# EAGLE design CarrierBoard (EAGLE 5.06)
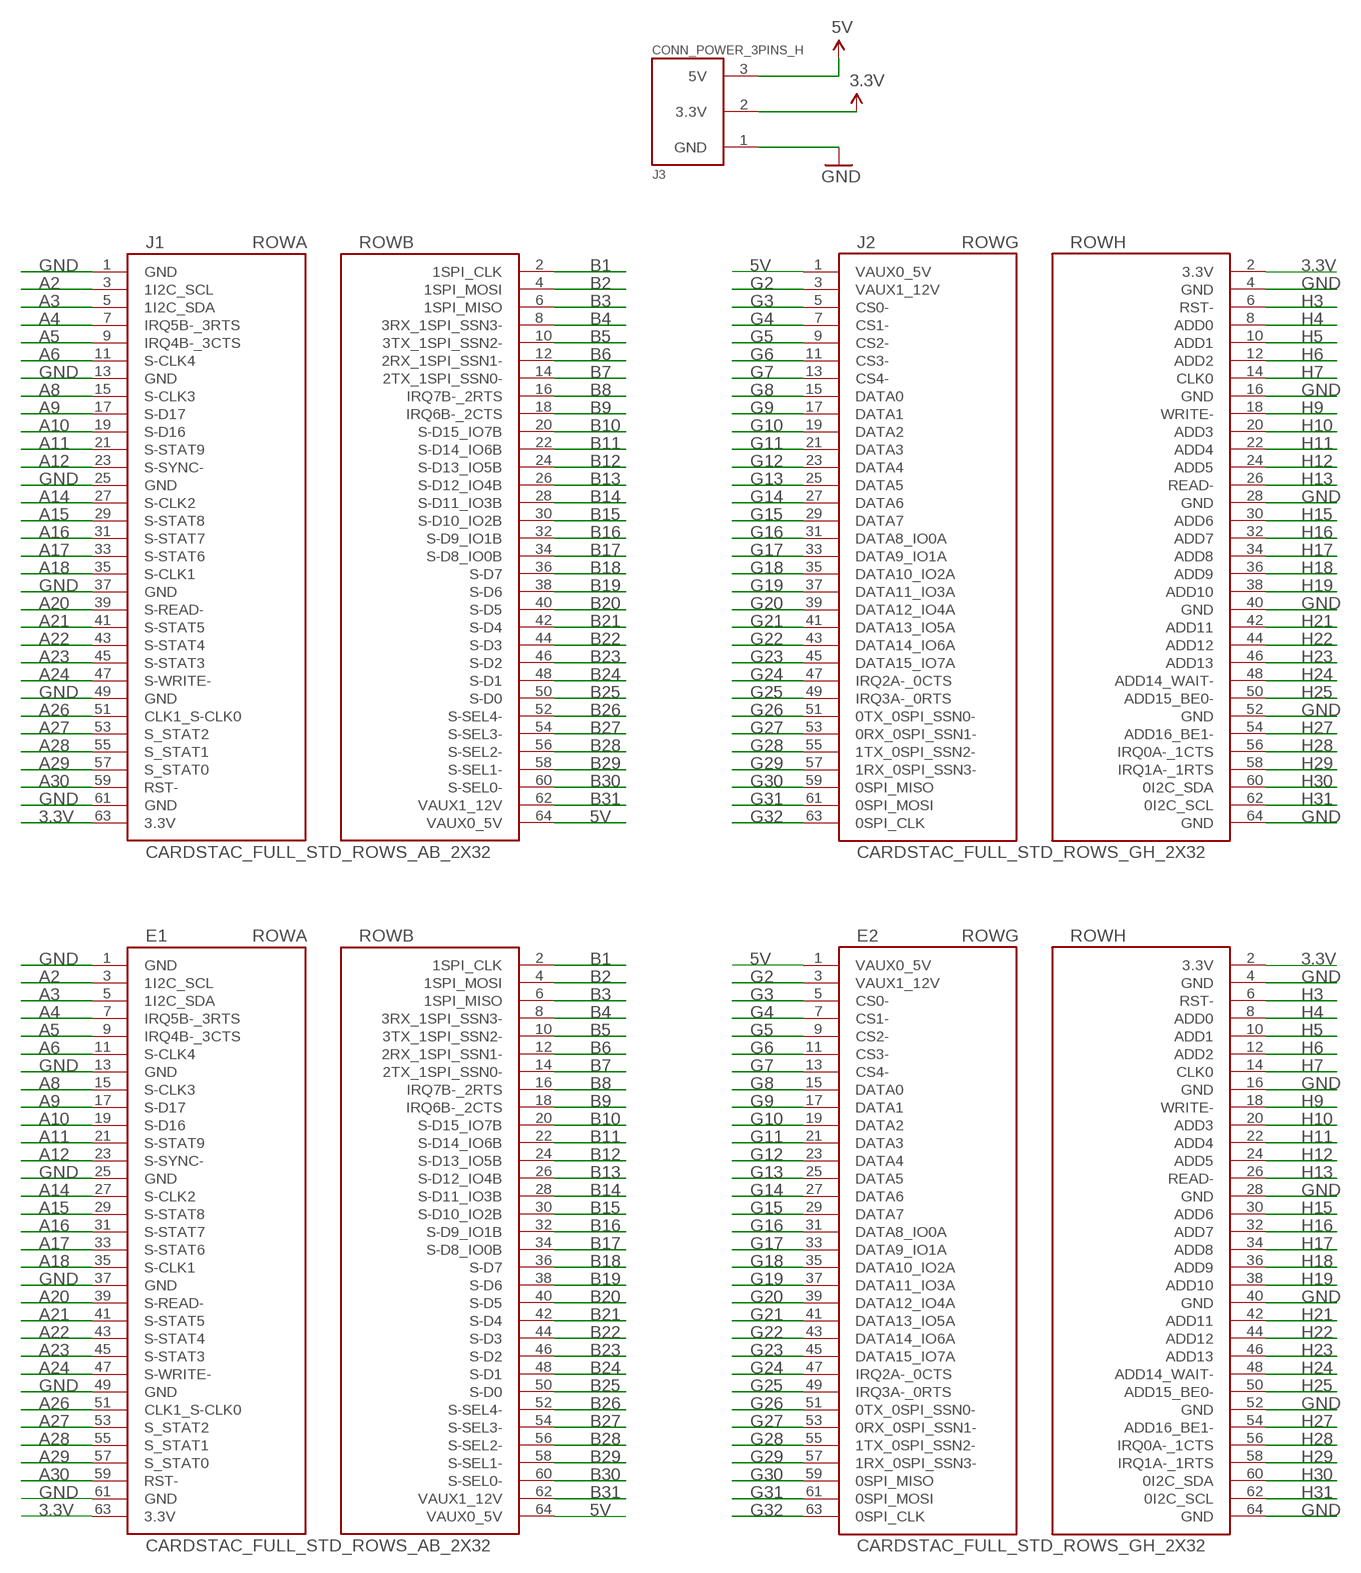
[diagram p0: schematic, sheet 1]

## Parts
E1  CARDSTAC_FULL_STD_ROWS_AB_2X32  [2X32]
E2  CARDSTAC_FULL_STD_ROWS_GH_2X32  [2X32]
J1  CARDSTAC_FULL_STD_ROWS_AB_2X32  [2X32]
J2  CARDSTAC_FULL_STD_ROWS_GH_2X32  [2X32]
J3  CONN_POWER_3PINS_H  [3PINS_3.81MM_90DEG]

## Nets
3.3V: E1.63(3.3V) E2.2(3.3V) J1.63(3.3V) J2.2(3.3V) J3.2(3.3V)
5V: E1.64(VAUX0_5V) E2.1(VAUX0_5V) J1.64(VAUX0_5V) J2.1(VAUX0_5V) J3.3(5V)
A2: E1.3(1I2C_SCL) J1.3(1I2C_SCL)
A3: E1.5(1I2C_SDA) J1.5(1I2C_SDA)
A4: E1.7(IRQ5B-_3RTS) J1.7(IRQ5B-_3RTS)
A5: E1.9(IRQ4B-_3CTS) J1.9(IRQ4B-_3CTS)
A6: E1.11(S-CLK4) J1.11(S-CLK4)
A8: E1.15(S-CLK3) J1.15(S-CLK3)
A9: E1.17(S-D17) J1.17(S-D17)
A10: E1.19(S-D16) J1.19(S-D16)
A11: E1.21(S-STAT9) J1.21(S-STAT9)
A12: E1.23(S-SYNC-) J1.23(S-SYNC-)
A14: E1.27(S-CLK2) J1.27(S-CLK2)
A15: E1.29(S-STAT8) J1.29(S-STAT8)
A16: E1.31(S-STAT7) J1.31(S-STAT7)
A17: E1.33(S-STAT6) J1.33(S-STAT6)
A18: E1.35(S-CLK1) J1.35(S-CLK1)
A20: E1.39(S-READ-) J1.39(S-READ-)
A21: E1.41(S-STAT5) J1.41(S-STAT5)
A22: E1.43(S-STAT4) J1.43(S-STAT4)
A23: E1.45(S-STAT3) J1.45(S-STAT3)
A24: E1.47(S-WRITE-) J1.47(S-WRITE-)
A26: E1.51(CLK1_S-CLK0) J1.51(CLK1_S-CLK0)
A27: E1.53(S_STAT2) J1.53(S_STAT2)
A28: E1.55(S_STAT1) J1.55(S_STAT1)
A29: E1.57(S_STAT0) J1.57(S_STAT0)
A30: E1.59(RST-) J1.59(RST-)
B1: E1.2(1SPI_CLK) J1.2(1SPI_CLK)
B2: E1.4(1SPI_MOSI) J1.4(1SPI_MOSI)
B3: E1.6(1SPI_MISO) J1.6(1SPI_MISO)
B4: E1.8(3RX_1SPI_SSN3-) J1.8(3RX_1SPI_SSN3-)
B5: E1.10(3TX_1SPI_SSN2-) J1.10(3TX_1SPI_SSN2-)
B6: E1.12(2RX_1SPI_SSN1-) J1.12(2RX_1SPI_SSN1-)
B7: E1.14(2TX_1SPI_SSN0-) J1.14(2TX_1SPI_SSN0-)
B8: E1.16(IRQ7B-_2RTS) J1.16(IRQ7B-_2RTS)
B9: E1.18(IRQ6B-_2CTS) J1.18(IRQ6B-_2CTS)
B10: E1.20(S-D15_IO7B) J1.20(S-D15_IO7B)
B11: E1.22(S-D14_IO6B) J1.22(S-D14_IO6B)
B12: E1.24(S-D13_IO5B) J1.24(S-D13_IO5B)
B13: E1.26(S-D12_IO4B) J1.26(S-D12_IO4B)
B14: E1.28(S-D11_IO3B) J1.28(S-D11_IO3B)
B15: E1.30(S-D10_IO2B) J1.30(S-D10_IO2B)
B16: E1.32(S-D9_IO1B) J1.32(S-D9_IO1B)
B17: E1.34(S-D8_IO0B) J1.34(S-D8_IO0B)
B18: E1.36(S-D7) J1.36(S-D7)
B19: E1.38(S-D6) J1.38(S-D6)
B20: E1.40(S-D5) J1.40(S-D5)
B21: E1.42(S-D4) J1.42(S-D4)
B22: E1.44(S-D3) J1.44(S-D3)
B23: E1.46(S-D2) J1.46(S-D2)
B24: E1.48(S-D1) J1.48(S-D1)
B25: E1.50(S-D0) J1.50(S-D0)
B26: E1.52(S-SEL4-) J1.52(S-SEL4-)
B27: E1.54(S-SEL3-) J1.54(S-SEL3-)
B28: E1.56(S-SEL2-) J1.56(S-SEL2-)
B29: E1.58(S-SEL1-) J1.58(S-SEL1-)
B30: E1.60(S-SEL0-) J1.60(S-SEL0-)
B31: E1.62(VAUX1_12V) J1.62(VAUX1_12V)
G2: E2.3(VAUX1_12V) J2.3(VAUX1_12V)
G3: E2.5(CS0-) J2.5(CS0-)
G4: E2.7(CS1-) J2.7(CS1-)
G5: E2.9(CS2-) J2.9(CS2-)
G6: E2.11(CS3-) J2.11(CS3-)
G7: E2.13(CS4-) J2.13(CS4-)
G8: E2.15(DATA0) J2.15(DATA0)
G9: E2.17(DATA1) J2.17(DATA1)
G10: E2.19(DATA2) J2.19(DATA2)
G11: E2.21(DATA3) J2.21(DATA3)
G12: E2.23(DATA4) J2.23(DATA4)
G13: E2.25(DATA5) J2.25(DATA5)
G14: E2.27(DATA6) J2.27(DATA6)
G15: E2.29(DATA7) J2.29(DATA7)
G16: E2.31(DATA8_IO0A) J2.31(DATA8_IO0A)
G17: E2.33(DATA9_IO1A) J2.33(DATA9_IO1A)
G18: E2.35(DATA10_IO2A) J2.35(DATA10_IO2A)
G19: E2.37(DATA11_IO3A) J2.37(DATA11_IO3A)
G20: E2.39(DATA12_IO4A) J2.39(DATA12_IO4A)
G21: E2.41(DATA13_IO5A) J2.41(DATA13_IO5A)
G22: E2.43(DATA14_IO6A) J2.43(DATA14_IO6A)
G23: E2.45(DATA15_IO7A) J2.45(DATA15_IO7A)
G24: E2.47(IRQ2A-_0CTS) J2.47(IRQ2A-_0CTS)
G25: E2.49(IRQ3A-_0RTS) J2.49(IRQ3A-_0RTS)
G26: E2.51(0TX_0SPI_SSN0-) J2.51(0TX_0SPI_SSN0-)
G27: E2.53(0RX_0SPI_SSN1-) J2.53(0RX_0SPI_SSN1-)
G28: E2.55(1TX_0SPI_SSN2-) J2.55(1TX_0SPI_SSN2-)
G29: E2.57(1RX_0SPI_SSN3-) J2.57(1RX_0SPI_SSN3-)
G30: E2.59(0SPI_MISO) J2.59(0SPI_MISO)
G31: E2.61(0SPI_MOSI) J2.61(0SPI_MOSI)
G32: E2.63(0SPI_CLK) J2.63(0SPI_CLK)
GND: E1.1(GND) E1.13(GND) E1.25(GND) E1.37(GND) E1.49(GND) E1.61(GND) E2.4(GND) E2.16(GND) E2.28(GND) E2.40(GND) E2.52(GND) E2.64(GND) J1.1(GND) J1.13(GND) J1.25(GND) J1.37(GND) J1.49(GND) J1.61(GND) J2.4(GND) J2.16(GND) J2.28(GND) J2.40(GND) J2.52(GND) J2.64(GND) J3.1(GND)
H3: E2.6(RST-) J2.6(RST-)
H4: E2.8(ADD0) J2.8(ADD0)
H5: E2.10(ADD1) J2.10(ADD1)
H6: E2.12(ADD2) J2.12(ADD2)
H7: E2.14(CLK0) J2.14(CLK0)
H9: E2.18(WRITE-) J2.18(WRITE-)
H10: E2.20(ADD3) J2.20(ADD3)
H11: E2.22(ADD4) J2.22(ADD4)
H12: E2.24(ADD5) J2.24(ADD5)
H13: E2.26(READ-) J2.26(READ-)
H15: E2.30(ADD6) J2.30(ADD6)
H16: E2.32(ADD7) J2.32(ADD7)
H17: E2.34(ADD8) J2.34(ADD8)
H18: E2.36(ADD9) J2.36(ADD9)
H19: E2.38(ADD10) J2.38(ADD10)
H21: E2.42(ADD11) J2.42(ADD11)
H22: E2.44(ADD12) J2.44(ADD12)
H23: E2.46(ADD13) J2.46(ADD13)
H24: E2.48(ADD14_WAIT-) J2.48(ADD14_WAIT-)
H25: E2.50(ADD15_BE0-) J2.50(ADD15_BE0-)
H27: E2.54(ADD16_BE1-) J2.54(ADD16_BE1-)
H28: E2.56(IRQ0A-_1CTS) J2.56(IRQ0A-_1CTS)
H29: E2.58(IRQ1A-_1RTS) J2.58(IRQ1A-_1RTS)
H30: E2.60(0I2C_SDA) J2.60(0I2C_SDA)
H31: E2.62(0I2C_SCL) J2.62(0I2C_SCL)

## Library data of the parts
E1 J1 = Robot:CARDSTAC_FULL_STD_ROWS_AB: Rows A and B of the Cardstac specification.
E2 J2 = Robot:CARDSTAC_FULL_STD_ROWS_GH: Rows G and H of the Cardstac specification.
J3 = Robot:CONN_POWER_3PINS: POWER CONNECTOR for logic boards. Provides 3.3V and 5V.

## Board
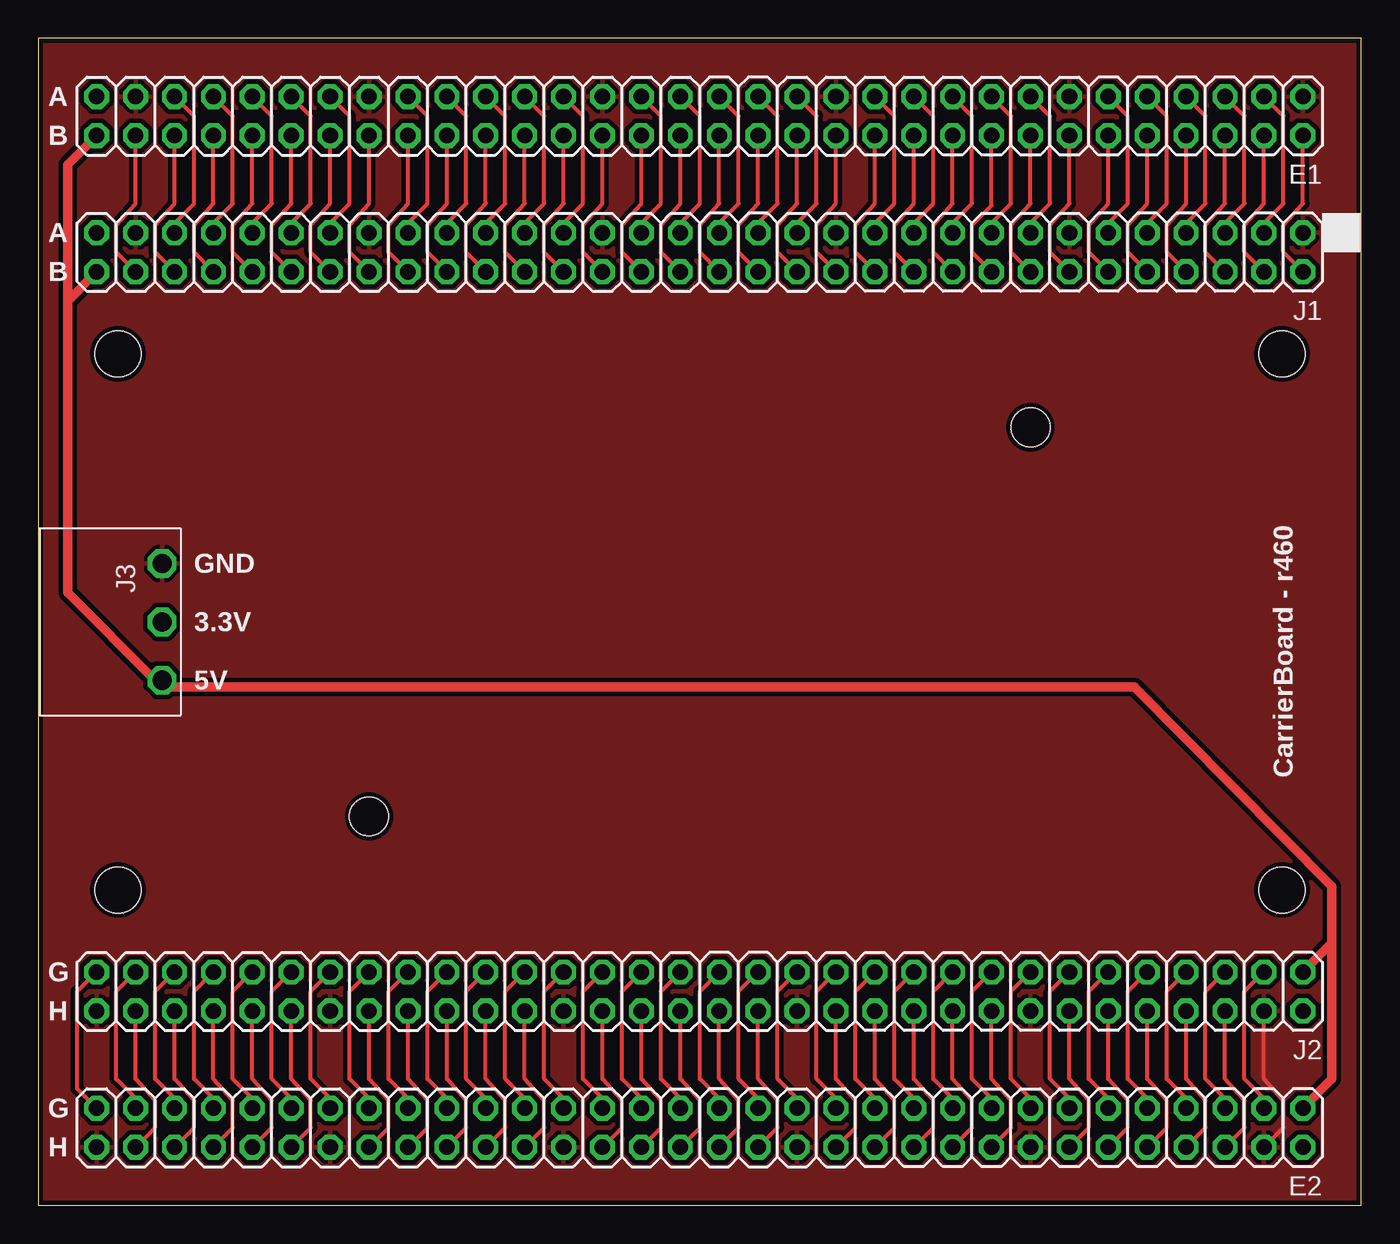
[diagram p1: board, top side]
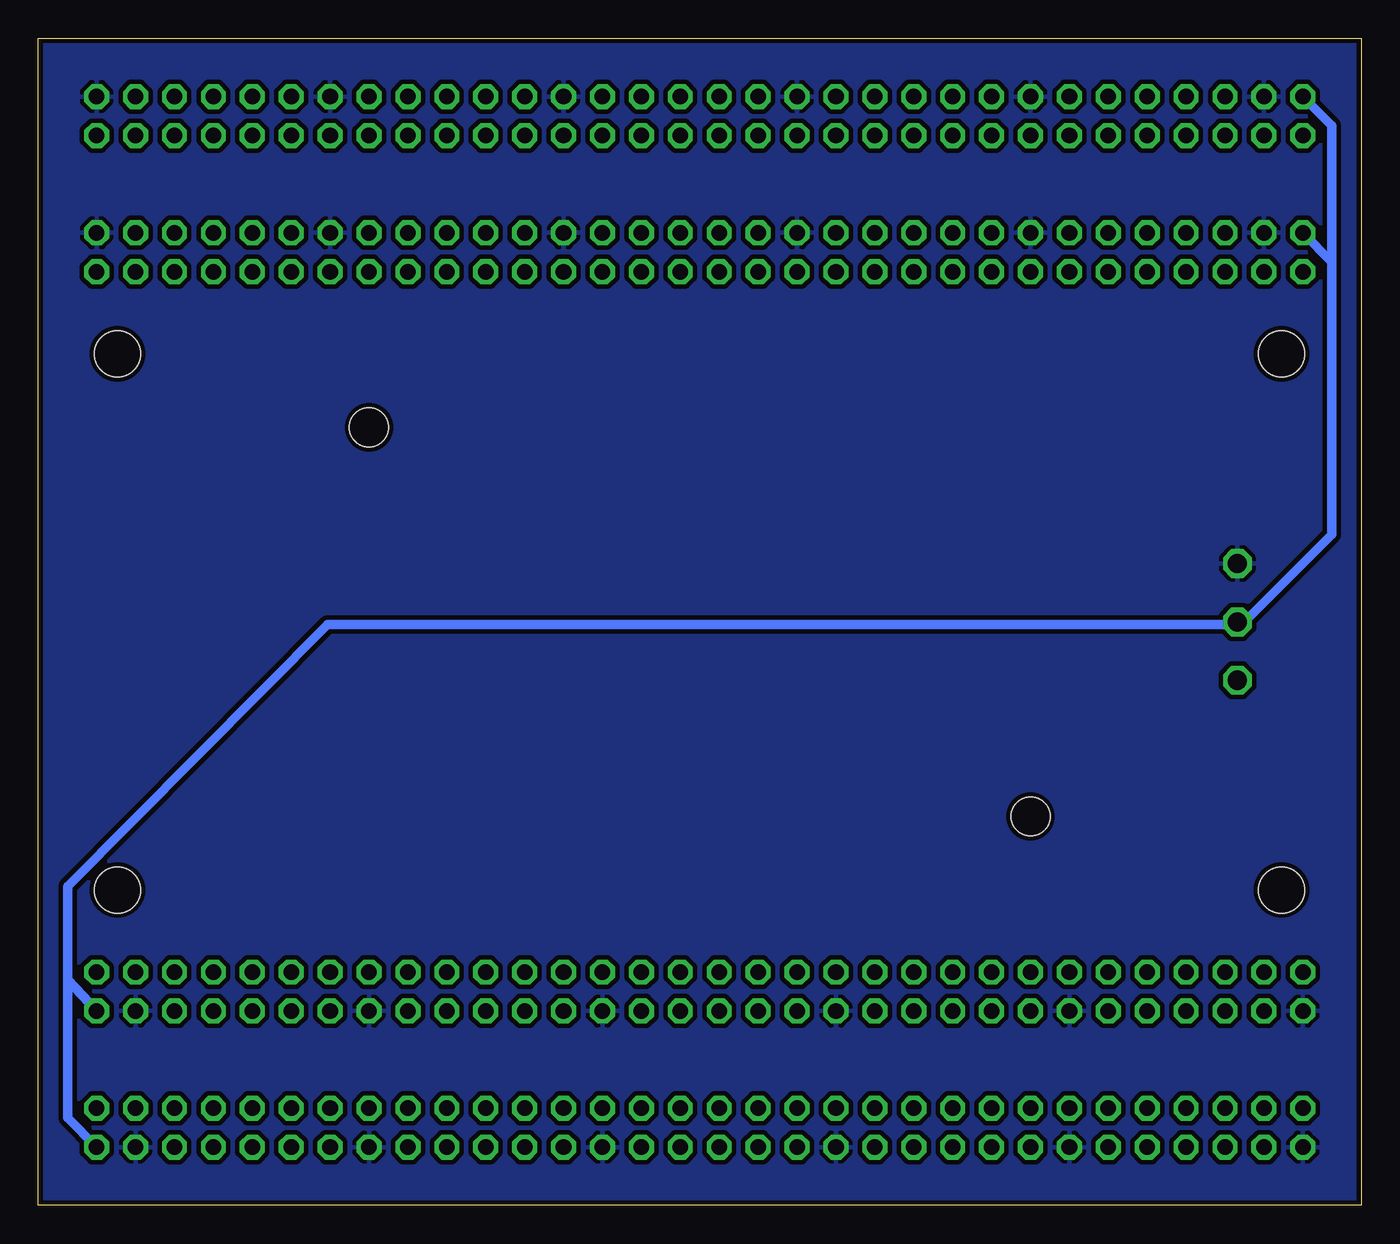
[diagram p2: board, bottom side, seen from below]

Size 86.36 x 76.2 mm. Coordinates in mm from the lower left corner, seen from the top.
Outline: 0,0 86.36,0 86.36,76.2 0,76.2 0,0
Copper layers (1*16): Top 0.035mm / dielectric 1.5mm / Bottom 0.035mm
Design rules "SparkFun": minimum track width 8mil, minimum drill 20mil, track to track 8mil, track to pad 8mil, pad to pad 8mil, via to via 8mil, smd to smd 8mil, copper to edge 10mil, drill to drill 8mil, minimum pad ring 12mil, minimum via ring 10mil, stop-mask expansion 4mil, vias tented up to drill 25mil, thermal gap 10mil
Holes 2.54 mm at 64.77,50.8 21.59,25.4
Holes 3 mm at 5.2,55.6 5.2,20.6 81.2,55.6 81.2,20.6

### Footprints (pad centres in the part's own frame; a part is rotated, then mirrored left to right if it is on the bottom)
2X32 = drill 1.016 octagon: 1 -39.37,-1.27; 2 -39.37,1.27; 3 -36.83,-1.27; 4 -36.83,1.27; 5 -34.29,-1.27; 6 -34.29,1.27; 7 -31.75,-1.27; 8 -31.75,1.27; 9 -29.21,-1.27; 10 -29.21,1.27; 11 -26.67,-1.27; 12 -26.67,1.27; 13 -24.13,-1.27; 14 -24.13,1.27; 15 -21.59,-1.27; 16 -21.59,1.27; 17 -19.05,-1.27; 18 -19.05,1.27; 19 -16.51,-1.27; 20 -16.51,1.27; 21 -13.97,-1.27; 22 -13.97,1.27; 23 -11.43,-1.27; 24 -11.43,1.27; 25 -8.89,-1.27; 26 -8.89,1.27; 27 -6.35,-1.27; 28 -6.35,1.27; 29 -3.81,-1.27; 30 -3.81,1.27; 31 -1.27,-1.27; 32 -1.27,1.27; 33 1.27,-1.27; 34 1.27,1.27; 35 3.81,-1.27; 36 3.81,1.27; 37 6.35,-1.27; 38 6.35,1.27; 39 8.89,-1.27; 40 8.89,1.27; 41 11.43,-1.27; 42 11.43,1.27; 43 13.97,-1.27; 44 13.97,1.27; 45 16.51,-1.27; 46 16.51,1.27; 47 19.05,-1.27; 48 19.05,1.27; 49 21.59,-1.27; 50 21.59,1.27; 51 24.13,-1.27; 52 24.13,1.27; 53 26.67,-1.27; 54 26.67,1.27; 55 29.21,-1.27; 56 29.21,1.27; 57 31.75,-1.27; 58 31.75,1.27; 59 34.29,-1.27; 60 34.29,1.27; 61 36.83,-1.27; 62 36.83,1.27; 63 39.37,-1.27; 64 39.37,1.27
3PINS_3.81MM_90DEG = drill 1.25 octagon: 1 -3.81,3; 2 0,3; 3 3.81,3

### Placement (x,y rotation side)
E1  43.18,71.12 180 top
E2  43.18,5.08 180 top
J1  43.18,62.23 180 top
J2  43.18,13.97 180 top
J3  5.08,38.1 270 top

### Tracks (layer width: path | path; a pad name or v marks a point on that pad's centre or on a via)
3.3V
  Bottom 0.61: E2.2 84.45,5.71 84.45,14.73 | 1.91,61.59 1.91,70.48 E1.63 | 7.62,38.1 1.91,43.81 1.91,61.59 | 1.91,61.59 J1.63 | 84.45,14.73 J2.2 | 7.62,38.1 7.78,37.94 67.47,37.94 84.45,20.83 84.45,14.73 | 7.62,38.1 J3.2
5V
  Top 0.61: E2.1 84.45,8.26 84.45,17.14 | 1.91,59.05 1.91,67.94 E1.64 | 7.62,34.29 1.91,40.01 1.91,59.05 | 1.91,59.05 J1.64 | 7.62,34.29 J3.3 | 7.62,34.29 8.05,33.86 71.55,33.86 84.45,20.83 84.45,17.14 | 84.45,17.14 J2.1
A2
  Top 0.254: J1.3 80.01,64.14 81.28,65.41 81.28,71.12 E1.3
A3
  Top 0.254: J1.5 77.47,64.14 78.74,65.41 78.74,71.12 E1.5
A4
  Top 0.254: J1.7 74.93,64.14 76.2,65.41 76.2,71.12 E1.7
A5
  Top 0.254: J1.9 72.39,64.14 73.66,65.41 73.66,71.12 E1.9
A6
  Top 0.254: J1.11 69.85,64.14 71.12,65.41 71.12,71.12 E1.11
A8
  Top 0.254: J1.15 64.77,64.14 66.04,65.41 66.04,71.12 E1.15
A9
  Top 0.254: J1.17 62.23,64.14 63.5,65.41 63.5,71.12 E1.17
A10
  Top 0.254: J1.19 59.69,64.14 60.96,65.41 60.96,71.12 E1.19
A11
  Top 0.254: J1.21 57.15,64.14 58.42,65.41 58.42,71.12 E1.21
A12
  Top 0.254: J1.23 54.61,64.14 55.88,65.41 55.88,71.12 E1.23
A14
  Top 0.254: J1.27 49.53,64.14 50.8,65.41 50.8,71.12 E1.27
A15
  Top 0.254: J1.29 46.99,64.14 48.26,65.41 48.26,71.12 E1.29
A16
  Top 0.254: J1.31 44.45,64.14 45.72,65.41 45.72,71.12 E1.31
A17
  Top 0.254: J1.33 41.91,64.14 43.18,65.41 43.18,71.12 E1.33
A18
  Top 0.254: J1.35 39.37,64.14 40.64,65.41 40.64,71.12 E1.35
A20
  Top 0.254: J1.39 34.29,64.14 35.56,65.41 35.56,71.12 E1.39
A21
  Top 0.254: J1.41 31.75,64.14 33.02,65.41 33.02,71.12 E1.41
A22
  Top 0.254: J1.43 29.21,64.14 30.48,65.41 30.48,71.12 E1.43
A23
  Top 0.254: J1.45 26.67,64.14 27.94,65.41 27.94,71.12 E1.45
A24
  Top 0.254: J1.47 24.13,64.14 25.4,65.41 25.4,71.12 E1.47
A26
  Top 0.254: J1.51 19.05,64.14 20.32,65.41 20.32,71.12 E1.51
A27
  Top 0.254: J1.53 16.51,64.14 17.78,65.41 17.78,71.12 E1.53
A28
  Top 0.254: J1.55 13.97,64.14 15.24,65.41 15.24,71.12 E1.55
A29
  Top 0.254: J1.57 11.43,64.14 12.7,65.41 12.7,71.12 E1.57
A30
  Top 0.254: J1.59 8.89,64.14 10.16,65.41 10.16,71.12 E1.59
B1
  Top 0.254: J1.2 81.28,62.23 81.28,64.01 82.55,65.41 E1.2
B2
  Top 0.254: J1.4 78.74,62.23 78.74,64.01 80.01,65.41 E1.4
B3
  Top 0.254: J1.6 76.2,62.23 76.2,64.01 77.47,65.41 E1.6
B4
  Top 0.254: J1.8 73.66,62.23 73.66,64.01 74.93,65.41 E1.8
B5
  Top 0.254: J1.10 71.12,62.23 71.12,64.01 72.39,65.41 E1.10
B6
  Top 0.254: J1.12 68.58,62.23 68.58,64.01 69.85,65.41 E1.12
B7
  Top 0.254: J1.14 66.04,62.23 66.04,64.01 67.31,65.41 E1.14
B8
  Top 0.254: J1.16 63.5,62.23 63.5,64.01 64.77,65.41 E1.16
B9
  Top 0.254: J1.18 60.96,62.23 60.96,64.01 62.23,65.28 E1.18
B10
  Top 0.254: J1.20 58.42,62.23 58.42,64.01 59.69,65.41 E1.20
B11
  Top 0.254: J1.22 55.88,62.23 55.88,64.01 57.15,65.41 E1.22
B12
  Top 0.254: J1.24 53.34,62.23 53.34,64.01 54.61,65.41 E1.24
B13
  Top 0.254: J1.26 50.8,62.23 50.8,64.01 52.07,65.41 E1.26
B14
  Top 0.254: J1.28 48.26,62.23 48.26,64.01 49.53,65.41 E1.28
B15
  Top 0.254: J1.30 45.72,62.23 45.72,64.01 46.99,65.41 E1.30
B16
  Top 0.254: J1.32 43.18,62.23 43.18,64.01 44.45,65.41 E1.32
B17
  Top 0.254: J1.34 40.64,62.23 40.64,64.01 41.91,65.41 E1.34
B18
  Top 0.254: J1.36 38.1,62.23 38.1,64.01 39.37,65.41 E1.36
B19
  Top 0.254: J1.38 35.56,62.23 35.56,64.01 36.83,65.41 E1.38
B20
  Top 0.254: J1.40 33.02,62.23 33.02,64.01 34.29,65.41 E1.40
B21
  Top 0.254: J1.42 30.48,62.23 30.48,64.01 31.75,65.41 E1.42
B22
  Top 0.254: J1.44 27.94,62.23 27.94,64.01 29.21,65.41 E1.44
B23
  Top 0.254: J1.46 25.4,62.23 25.4,64.01 26.67,65.41 E1.46
B24
  Top 0.254: J1.48 22.86,62.23 22.86,64.01 24.13,65.41 E1.48
B25
  Top 0.254: J1.50 20.32,62.23 20.32,64.01 21.59,65.41 E1.50
B26
  Top 0.254: J1.52 17.78,62.23 17.78,64.01 19.05,65.41 E1.52
B27
  Top 0.254: J1.54 15.24,62.23 15.24,64.01 16.51,65.41 E1.54
B28
  Top 0.254: J1.56 12.7,62.23 12.7,64.01 13.97,65.41 E1.56
B29
  Top 0.254: J1.58 10.16,62.23 10.16,64.01 11.43,65.41 E1.58
B30
  Top 0.254: J1.60 7.62,62.23 7.62,64.01 8.89,65.41 E1.60
B31
  Top 0.254: J1.62 5.08,62.23 5.08,64.01 6.35,65.41 E1.62
G2
  Top 0.254: E2.3 80.01,6.99 78.74,8.26 78.74,13.97 J2.3
G3
  Top 0.254: E2.5 77.47,6.99 76.2,8.26 76.2,13.97 J2.5
G4
  Top 0.254: E2.7 74.93,6.99 73.66,8.26 73.66,13.97 J2.7
G5
  Top 0.254: E2.9 72.39,6.99 71.12,8.26 71.12,13.97 J2.9
G6
  Top 0.254: E2.11 69.85,6.99 68.58,8.26 68.58,13.97 J2.11
G7
  Top 0.254: E2.13 67.31,6.99 66.04,8.26 66.04,13.97 J2.13
G8
  Top 0.254: E2.15 64.77,6.99 63.5,8.26 63.5,13.97 J2.15
G9
  Top 0.254: E2.17 62.23,6.99 60.96,8.26 60.96,13.97 J2.17
G10
  Top 0.254: E2.19 59.69,6.99 58.42,8.26 58.42,13.97 J2.19
G11
  Top 0.254: E2.21 57.15,6.99 55.88,8.26 55.88,13.97 J2.21
G12
  Top 0.254: E2.23 54.61,6.99 53.34,8.26 53.34,13.97 J2.23
G13
  Top 0.254: E2.25 52.07,6.99 50.8,8.26 50.8,13.97 J2.25
G14
  Top 0.254: E2.27 49.53,6.99 48.26,8.26 48.26,13.97 J2.27
G15
  Top 0.254: E2.29 46.99,6.99 45.72,8.26 45.72,13.97 J2.29
G16
  Top 0.254: E2.31 44.45,6.99 43.18,8.26 43.18,13.97 J2.31
G17
  Top 0.254: E2.33 41.91,6.99 40.64,8.26 40.64,13.97 J2.33
G18
  Top 0.254: E2.35 39.37,6.99 38.1,8.26 38.1,13.97 J2.35
G19
  Top 0.254: E2.37 36.83,6.99 35.56,8.26 35.56,13.97 J2.37
G20
  Top 0.254: E2.39 34.29,6.99 33.02,8.26 33.02,13.97 J2.39
G21
  Top 0.254: E2.41 31.75,6.99 30.48,8.26 30.48,13.97 J2.41
G22
  Top 0.254: E2.43 29.21,6.99 27.94,8.26 27.94,13.97 J2.43
G23
  Top 0.254: E2.45 26.67,6.99 25.4,8.26 25.4,13.97 J2.45
G24
  Top 0.254: E2.47 24.13,6.99 22.86,8.26 22.86,13.97 J2.47
G25
  Top 0.254: E2.49 21.59,6.99 20.32,8.26 20.32,13.97 J2.49
G26
  Top 0.254: E2.51 19.05,6.99 17.78,8.26 17.78,13.97 J2.51
G27
  Top 0.254: E2.53 16.51,6.99 15.24,8.26 15.24,13.97 J2.53
G28
  Top 0.254: E2.55 13.97,6.99 12.7,8.26 12.7,13.97 J2.55
G29
  Top 0.254: E2.57 11.43,6.99 10.16,8.26 10.16,13.97 J2.57
G30
  Top 0.254: E2.59 8.89,6.99 7.62,8.26 7.62,13.97 J2.59
G31
  Top 0.254: E2.61 6.35,6.99 5.08,8.26 5.08,13.97 J2.61
G32
  Top 0.254: E2.63 2.54,7.62 2.54,13.97 J2.63
GND
  Top 0.254: E2.4 81.28,5.08 81.28,6.86 80.01,8.26 J2.4
  pour Bottom (isolate 0.305): 0,0 86.36,0 86.36,76.2 0,76.2
  pour Top (isolate 0.305): 0,76.2 86.36,76.2 86.36,0 0,0
H3
  Top 0.254: E2.6 78.74,5.08 78.74,6.86 77.47,8.26 J2.6
H4
  Top 0.254: E2.8 76.2,5.08 76.2,6.86 74.93,8.26 J2.8
H5
  Top 0.254: E2.10 73.66,5.08 73.66,6.86 72.39,8.26 J2.10
H6
  Top 0.254: E2.12 71.12,5.08 71.12,6.86 69.85,8.26 J2.12
H7
  Top 0.254: E2.14 68.58,5.08 68.58,6.86 67.31,8.26 J2.14
H9
  Top 0.254: E2.18 63.5,5.08 63.5,6.86 62.23,8.26 J2.18
H10
  Top 0.254: E2.20 60.96,5.08 60.96,6.86 59.69,8.26 J2.20
H11
  Top 0.254: E2.22 58.42,5.08 58.42,6.86 57.15,8.26 J2.22
H12
  Top 0.254: E2.24 55.88,5.08 55.88,6.86 54.61,8.26 J2.24
H13
  Top 0.254: E2.26 53.34,5.08 53.34,6.86 52.07,8.26 J2.26
H15
  Top 0.254: E2.30 48.26,5.08 48.26,6.86 46.99,8.26 J2.30
H16
  Top 0.254: E2.32 45.72,5.08 45.72,6.86 44.45,8.26 J2.32
H17
  Top 0.254: E2.34 43.18,5.08 43.18,6.86 41.91,8.26 J2.34
H18
  Top 0.254: E2.36 40.64,5.08 40.64,6.86 39.37,8.26 J2.36
H19
  Top 0.254: E2.38 38.1,5.08 38.1,6.86 36.83,8.26 J2.38
H21
  Top 0.254: E2.42 33.02,5.08 33.02,6.86 31.75,8.26 J2.42
H22
  Top 0.254: E2.44 30.48,5.08 30.48,6.86 29.21,8.26 J2.44
H23
  Top 0.254: E2.46 27.94,5.08 27.94,6.86 26.67,8.26 J2.46
H24
  Top 0.254: E2.48 25.4,5.08 25.4,6.86 24.13,8.26 J2.48
H25
  Top 0.254: E2.50 22.86,5.08 22.86,6.86 21.59,8.26 J2.50
H27
  Top 0.254: E2.54 17.78,5.08 17.78,6.86 16.51,8.26 J2.54
H28
  Top 0.254: E2.56 15.24,5.08 15.24,6.86 13.97,8.26 J2.56
H29
  Top 0.254: E2.58 12.7,5.08 12.7,6.86 11.43,8.26 J2.58
H30
  Top 0.254: E2.60 10.16,5.08 10.16,6.86 8.89,8.26 J2.60
H31
  Top 0.254: E2.62 7.62,5.08 7.62,6.86 6.35,8.26 J2.62

### Text on the board
tPlace: A | B | A | B | GND | 3.3V | 5V | CarrierBoard - r460 | G | H | G | H